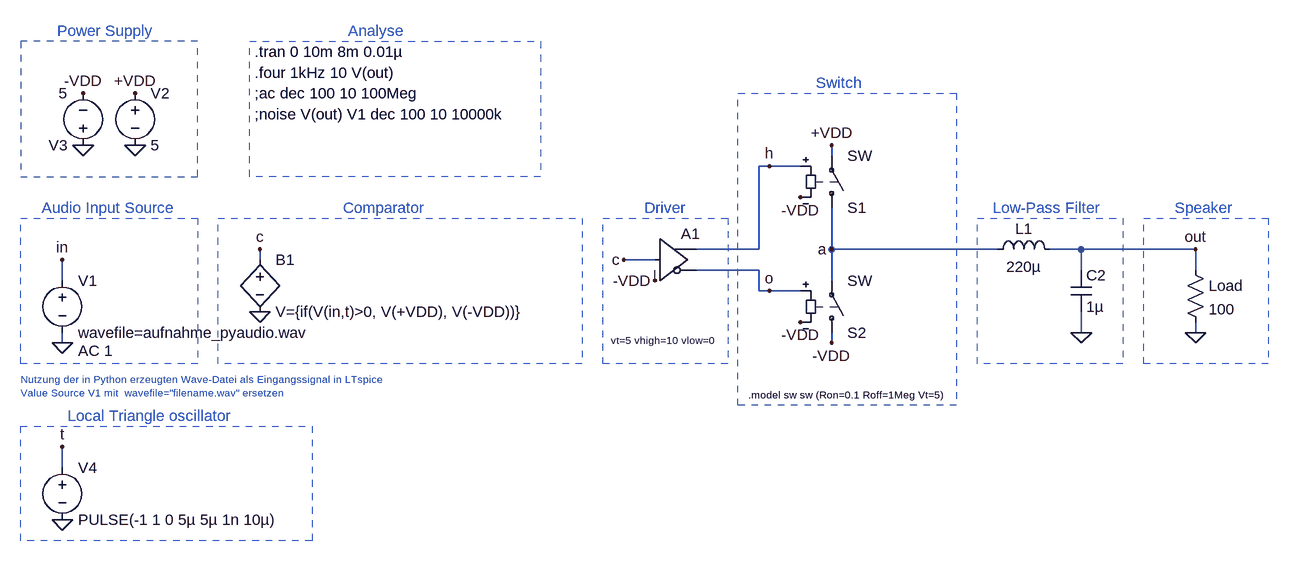
[diagram p0: schematic V6_1.asc]
V6_1.asc, the LTspice schematic file:
Version 4
SHEET 1 1268 680
WIRE 464 64 464 48
WIRE 368 80 352 80
WIRE 416 80 368 80
WIRE 352 208 352 80
WIRE 352 208 256 208
WIRE 464 208 464 144
WIRE 720 208 464 208
WIRE 848 208 800 208
WIRE 1024 208 848 208
WIRE -416 224 -416 208
WIRE 192 224 144 224
WIRE 352 240 256 240
WIRE 848 240 848 208
WIRE 1024 240 1024 208
WIRE -720 256 -720 224
WIRE 464 256 464 208
WIRE 352 272 352 240
WIRE 368 272 352 272
WIRE 416 272 368 272
WIRE 848 336 848 304
WIRE 1024 336 1024 320
WIRE -720 352 -720 336
WIRE 464 352 464 336
WIRE -720 544 -720 512
FLAG -720 352 0
FLAG 192 256 -VDD
FLAG 416 320 -VDD
FLAG 416 128 -VDD
FLAG -688 -32 -VDD
FLAG -608 -32 +VDD
FLAG -720 512 t
FLAG 144 224 c
FLAG 368 80 h
FLAG 368 272 o
FLAG -720 224 in
FLAG 464 208 a
FLAG -720 624 0
FLAG 1024 336 0
FLAG -688 48 0
FLAG -608 48 0
FLAG 848 336 0
FLAG 1024 208 out
FLAG -416 304 0
FLAG -416 208 c
FLAG 464 48 +VDD
FLAG 464 352 -VDD
SYMBOL voltage -720 240 R0
WINDOW 123 24 124 Left 2
WINDOW 39 0 0 Left 0
SYMATTR Value2 AC 1
SYMATTR InstName V1
SYMATTR Value wavefile=aufnahme_pyaudio.wav
SYMBOL Digital\\buf 192 160 R0
WINDOW 3 -68 188 Left 1
SYMATTR Value vt=5 vhigh=10 vlow=0
SYMATTR InstName A1
SYMBOL sw 464 160 M180
SYMATTR InstName S1
SYMBOL sw 464 352 M180
SYMATTR InstName S2
SYMBOL ind 704 224 R270
WINDOW 0 32 56 VTop 2
WINDOW 3 5 56 VBottom 2
SYMATTR InstName L1
SYMATTR Value 220µ
SYMBOL cap 832 240 R0
SYMATTR InstName C2
SYMATTR Value 1µ
SYMBOL voltage -608 -48 R0
WINDOW 123 0 0 Left 0
WINDOW 39 0 0 Left 0
SYMATTR InstName V2
SYMATTR Value 5
SYMBOL voltage -688 64 R180
WINDOW 123 0 0 Left 0
WINDOW 39 0 0 Left 0
SYMATTR InstName V3
SYMATTR Value 5
SYMBOL voltage -720 528 R0
WINDOW 123 0 0 Left 0
WINDOW 39 0 0 Left 0
SYMATTR Value PULSE(-1 1 0 5µ 5µ 1n 10µ)
SYMATTR InstName V4
SYMBOL res 1008 224 R0
SYMATTR InstName Load
SYMATTR Value 100
SYMBOL bv -416 208 R0
SYMATTR InstName B1
SYMATTR Value V={if(V(in,t)>0, V(+VDD), V(-VDD))}
TEXT 336 432 Left 1 !.model sw sw (Ron=0.1 Roff=1Meg Vt=5)
TEXT -752 144 Left 2 ;Audio Input Source
TEXT -712 464 Left 2 ;Local Triangle oscillator
TEXT -424 -96 Left 2 !.tran 0 10m 8m 0.01µ
TEXT -424 -64 Left 2 !.four 1kHz 10 V(out)
TEXT -424 -32 Left 2 !;ac dec 100 10 100Meg
TEXT -424 0 Left 2 !;noise V(out) V1 dec 100 10 10000k
TEXT -728 -128 Left 2 ;Power Supply
TEXT -280 -128 Left 2 ;Analyse
TEXT -288 144 Left 2 ;Comparator
TEXT 440 -48 Left 2 ;Switch
TEXT 712 144 Left 2 ;Low-Pass Filter
TEXT 992 144 Left 2 ;Speaker
TEXT 176 144 Left 2 ;Driver
TEXT -784 408 Left 1 ;Nutzung der in Python erzeugten Wave-Datei als Eingangssignal in LTspice\nValue Source V1 mit  wavefile="filename.wav" ersetzen
RECTANGLE Normal -512 384 -784 160 2
RECTANGLE Normal 304 384 112 160 2
RECTANGLE Normal 656 448 320 -32 2
RECTANGLE Normal 912 384 688 160 2
RECTANGLE Normal -512 -112 -784 96 2
RECTANGLE Normal 16 96 -432 -112 2
RECTANGLE Normal 1136 384 944 160 2
RECTANGLE Normal -336 656 -784 480 2
RECTANGLE Normal 80 384 -480 160 2

The netlist it stands for:
* V6_1.asc
V1 in 0 wavefile=aufnahme_pyaudio.wav AC 1
A1 c -VDD -VDD -VDD -VDD o h -VDD BUF vt=5 vhigh=10 vlow=0
S1 a +VDD h -VDD SW
S2 -VDD a o -VDD SW
L1 a out 220µ
C2 out 0 1µ
V2 +VDD 0 5
V3 0 -VDD 5
V4 t 0 PULSE(-1 1 0 5µ 5µ 1n 10µ)
R§Load out 0 100
B1 c 0 V={if(V(in,t)>0, V(+VDD), V(-VDD))}
.model sw sw (Ron=0.1 Roff=1Meg Vt=5)
* Audio Input Source
* Local Triangle oscillator
.tran 0 10m 8m 0.01µ
.four 1kHz 10 V(out)
;ac dec 100 10 100Meg
;noise V(out) V1 dec 100 10 10000k
* Power Supply
* Analyse
* Comparator
* Switch
* Low-Pass Filter
* Speaker
* Driver
* Nutzung der in Python erzeugten Wave-Datei als Eingangssignal in LTspice
* Value Source V1 mit  wavefile="filename.wav" ersetzen
.backanno
.end